# Altium schematic sheet 07.USB Device_MicroUSB_CON.SchDoc
size A4; CompanyName: 广州致远电子有限公司; DocumentNumber: 6; SheetNumber: 6; SheetTotal: 8; PageSetup: Record=PageOptions|CenterHorizontal=True|CenterVertical=True|PrintScale=1.00|XCorrection=1.00|YCorrection=1.00|PrintKind=0|BorderSize=5000000|LeftOffset=0|BottomOffset=0|Orientation=2|PaperLength=1000|PaperWidth=1000|Scale=100|PaperSource=7|PrintQuality=600|MediaType=1|DitherType=10|PaperKind=A4|PrintScaleMode=1; DesignDate: 20180913; SheetName: USB接口电路; SheetVersion: <图纸版本>; SheetDescription: USB接口电路，纯供电，没有usb信号
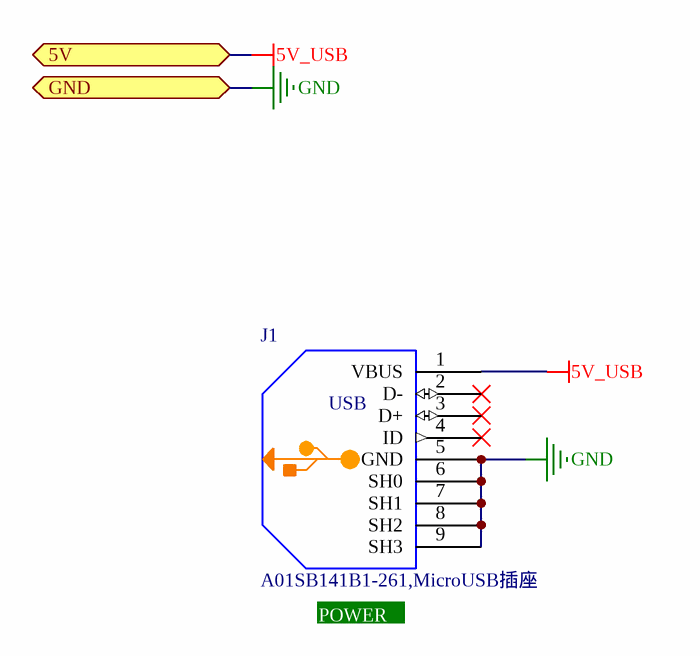
[diagram p0: 07.USB Device_MicroUSB_CON.SchDoc]

## Parts
J1  A01SB141B1-261,MicroUSB插座  [MICROUSB-5S]

## Ports
5V, GND

## Nets
5V_USB: J1.1(VBUS) ; port 5V
GND: J1.5(GND) J1.6(SH0) J1.7(SH1) J1.8(SH2) J1.9(SH3) ; port GND

Not connected (* = marked no-connect by the designer): J1 2(D-)* 3(D+)* 4(ID)*

## Notes on the sheet
- (near J1) POWER
- 1
- #
- 修改日期
- 修改内容
- 2
- 3
- 设计人员
- 审核人员
- 设计日期
- 审核日期
- 产品名称
- 图纸名称
- 产品型号
- 图纸描述
- 图纸版本
- A4
- (in symbol 1.10.12.0014) USB

## Library data of the parts
J1 = 1.10.12.0014: A01SB141B1-261,MicroUSB插座,SMT,艾立信,RoHS; PCB备注: 141030lmd; 器件优选方案: 正常状态，可以选用; 物料代码: 1.10.12.0014; Value: A01SB141B1-261,MicroUSB插座; 名称: MicroUSB插座; 封装: SMT; 厂商: 艾立信; RoHS: RoHS; 型号: A01SB141B1-261,MicroUSB插座; 贴片和直插: SMT; ComponentLink1Description: ErpDataInfo; ComponentLink1URL: http://erp.zlgmcu.com/ErpExt/ErpData/ListMateriel.aspx?pkey=1.10.12.0014